# Altium project C2Sv0 - Adaptor.PrjPcb
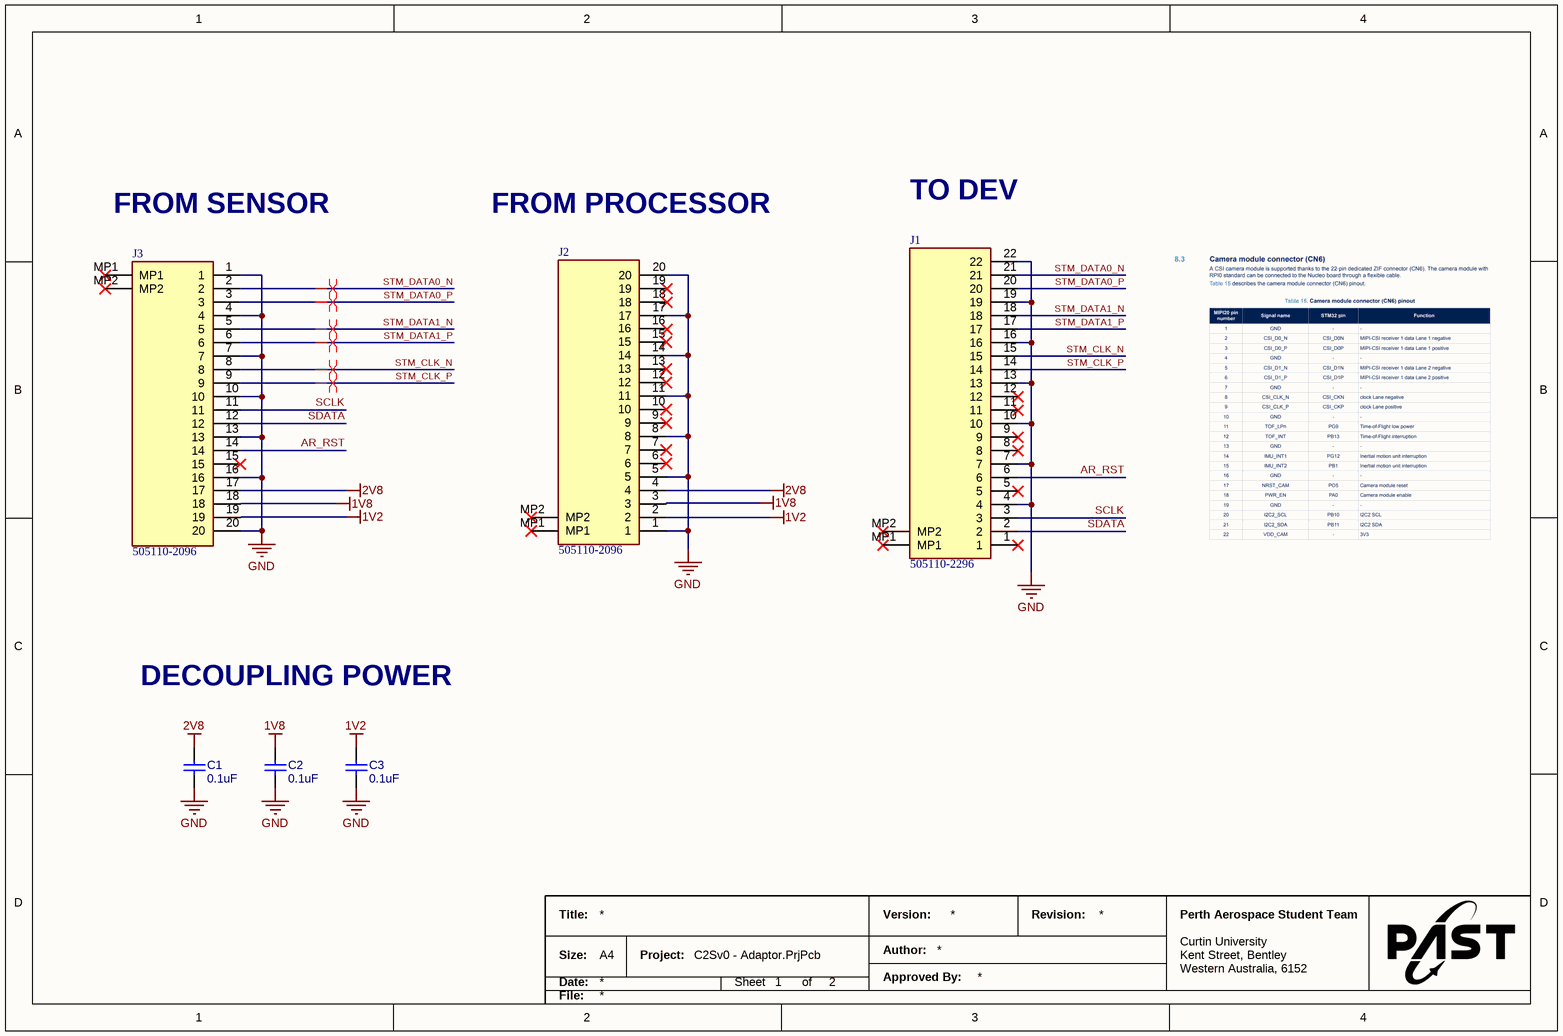
[diagram p0: C2Sv0 - Adaptor_TopLevel.SchDoc]
1 sheet, 6 parts. Net scope: global (net labels, ports and power ports of the same name join across sheets).
Board file: C2Sv0 - Adaptor.PcbDoc

## Sheet C2Sv0 - Adaptor_TopLevel.SchDoc
size A4; SheetNumber: 1; SheetTotal: 2

### Parts
C1  value 0.1uF  [C0603]  (hidden comment: MCD-00237)
C2  value 0.1uF  [C0603]  (hidden comment: MCD-00237)
C3  value 0.1uF  [C0603]  (hidden comment: MCD-00237)
J1  505110-2296  [505110-2296]
J2  505110-2096  [505110-2096]
J3  505110-2096  [505110-2096]

### Nets
1V2: C3.2 J2.2 J3.19
1V8: C2.2 J2.3 J3.18
2V8: C1.2 J2.4 J3.17
GND: C1.1 C2.1 C3.1 J1.4 J1.7 J1.10 J1.13 J1.16 J1.19 J1.22 J2.1 J2.5 J2.8 J2.11 J2.14 J2.17 J2.20 J3.1 J3.4 J3.7 J3.10 J3.13 J3.16 J3.20
AR_RST: J1.6 J3.14
SCLK: J1.3 J3.11
SDATA: J1.2 J3.12
STM_CLK_N: J1.15 J3.8
STM_CLK_P: J1.14 J3.9
STM_DATA0_N: J1.21 J3.2
STM_DATA0_P: J1.20 J3.3
STM_DATA1_N: J1.18 J3.5
STM_DATA1_P: J1.17 J3.6

Not connected (* = marked no-connect by the designer): J1 1* 5* 8* 9* 11* 12* MP1* MP2*; J2 6* 7* 9* 10* 12* 13* 15* 16 18* 19* MP1* MP2*; J3 15* MP1* MP2*

### Layout directives
differential pair: STM_CLK_N, STM_CLK_P, STM_DATA0_N, STM_DATA0_P, STM_DATA1_N, STM_DATA1_P

### Notes on the sheet
- FROM SENSOR
- FROM PROCESSOR
- TO DEV
- DECOUPLING POWER
- Title:
- Version:
- Revision:
- Perth Aerospace Student Team
- Size:
- Date:
- A4
- Project:
- Sheet
- of
- Author:
- Approved By:
- Curtin University
- Kent Street, Bentley
- Western Australia, 6152
- File:

### Library data of the parts
C1-C3 = CMP-112-000001-1: Capacitor, MLCC, 100nF, 6V3, X5R, 10%, 0603, T=0,8mm; Manufacturer Part Number: CC0603KRX5R5BB104; Manufacturer: YAGEO; ECCN_EU: NEC; Provided_By: SUBCO; ECCN_US: EAR99; Status: Released; ComponentLink1Description: Datasheet; Component Type: Capacitors; Pin Count: 2; Package: C0603; Source: MB1364.SCHLIB; Design Item ID: MCD-00237; Part_Type: Capacitor; Internal_Part_Number: MCD-00237; ComponentLink1URL: http://tunmcdsvn.tun.st.com/Component_Datasheet_Library/Trunk/Capacitors/Yageo_Multilayer_capacitor_X5R_series_100pF_to_100uF; Manufacturer_Part_Number: CC0603KRX5R5BB104
J1 = 505110-2296: Connector; Manufacturer_Name: Molex; Datasheet Link: https://www.molex.com/pdm_docs/sd/5051102296_sd.pdf; Height: 2.1mm; Manufacturer_Part_Number: 505110-2296; Mouser Part Number: 538-505110-2296; Mouser Price/Stock: https://www.mouser.co.uk/ProductDetail/Molex/505110-2296?qs=IvjI65BR3TWV%252BB%252BT0zqCcg%3D%3D
J2 J3 = 505110-2096: Connector; Manufacturer_Name: Molex; Datasheet Link: https://componentsearchengine.com/Datasheets/1/505110-2096.pdf; Height: 2.1mm; Manufacturer_Part_Number: 505110-2096; Mouser Part Number: 538-505110-2096; Mouser Price/Stock: https://www.mouser.co.uk/ProductDetail/Molex/505110-2096?qs=IvjI65BR3TVK2gHWyfgM0A%3D%3D